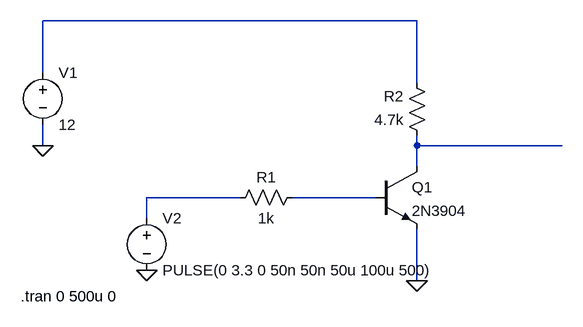
[diagram p0: schematic LevelShifter.asc]
LevelShifter.asc, the LTspice schematic file:
Version 4
SHEET 1 880 680
WIRE 256 -80 -320 -80
WIRE -320 0 -320 -80
WIRE 256 16 256 -80
WIRE -320 112 -320 80
WIRE 256 112 256 96
WIRE 480 112 256 112
WIRE 256 144 256 112
WIRE -16 192 -160 192
WIRE 192 192 64 192
WIRE -160 224 -160 192
WIRE 256 320 256 240
FLAG -320 112 0
FLAG -160 304 0
FLAG 256 320 0
SYMBOL npn 192 144 R0
SYMATTR InstName Q1
SYMATTR Value 2N3904
SYMBOL res 80 176 R90
WINDOW 0 0 56 VBottom 2
WINDOW 3 32 56 VTop 2
SYMATTR InstName R1
SYMATTR Value 1k
SYMBOL res 272 112 R180
WINDOW 0 36 76 Left 2
WINDOW 3 36 40 Left 2
SYMATTR InstName R2
SYMATTR Value 4.7k
SYMBOL voltage -320 -16 R0
WINDOW 123 0 0 Left 0
WINDOW 39 0 0 Left 0
SYMATTR InstName V1
SYMATTR Value 12
SYMBOL voltage -160 208 R0
WINDOW 123 0 0 Left 0
WINDOW 39 0 0 Left 0
SYMATTR InstName V2
SYMATTR Value PULSE(0 3.3 0 50n 50n 50u 100u 500)
TEXT -354 344 Left 2 !.tran 0 500u 0

The netlist it stands for:
* LevelShifter.asc
Q1 N002 N004 0 0 2N3904
R1 N004 N003 1k
R2 N002 N001 4.7k
V1 N001 0 12
V2 N003 0 PULSE(0 3.3 0 50n 50n 50u 100u 500)
.model NPN NPN
.model PNP PNP
.lib standard.bjt
.tran 0 500u 0
.backanno
.end